# Altium schematic sheet core.SchDoc
size A4
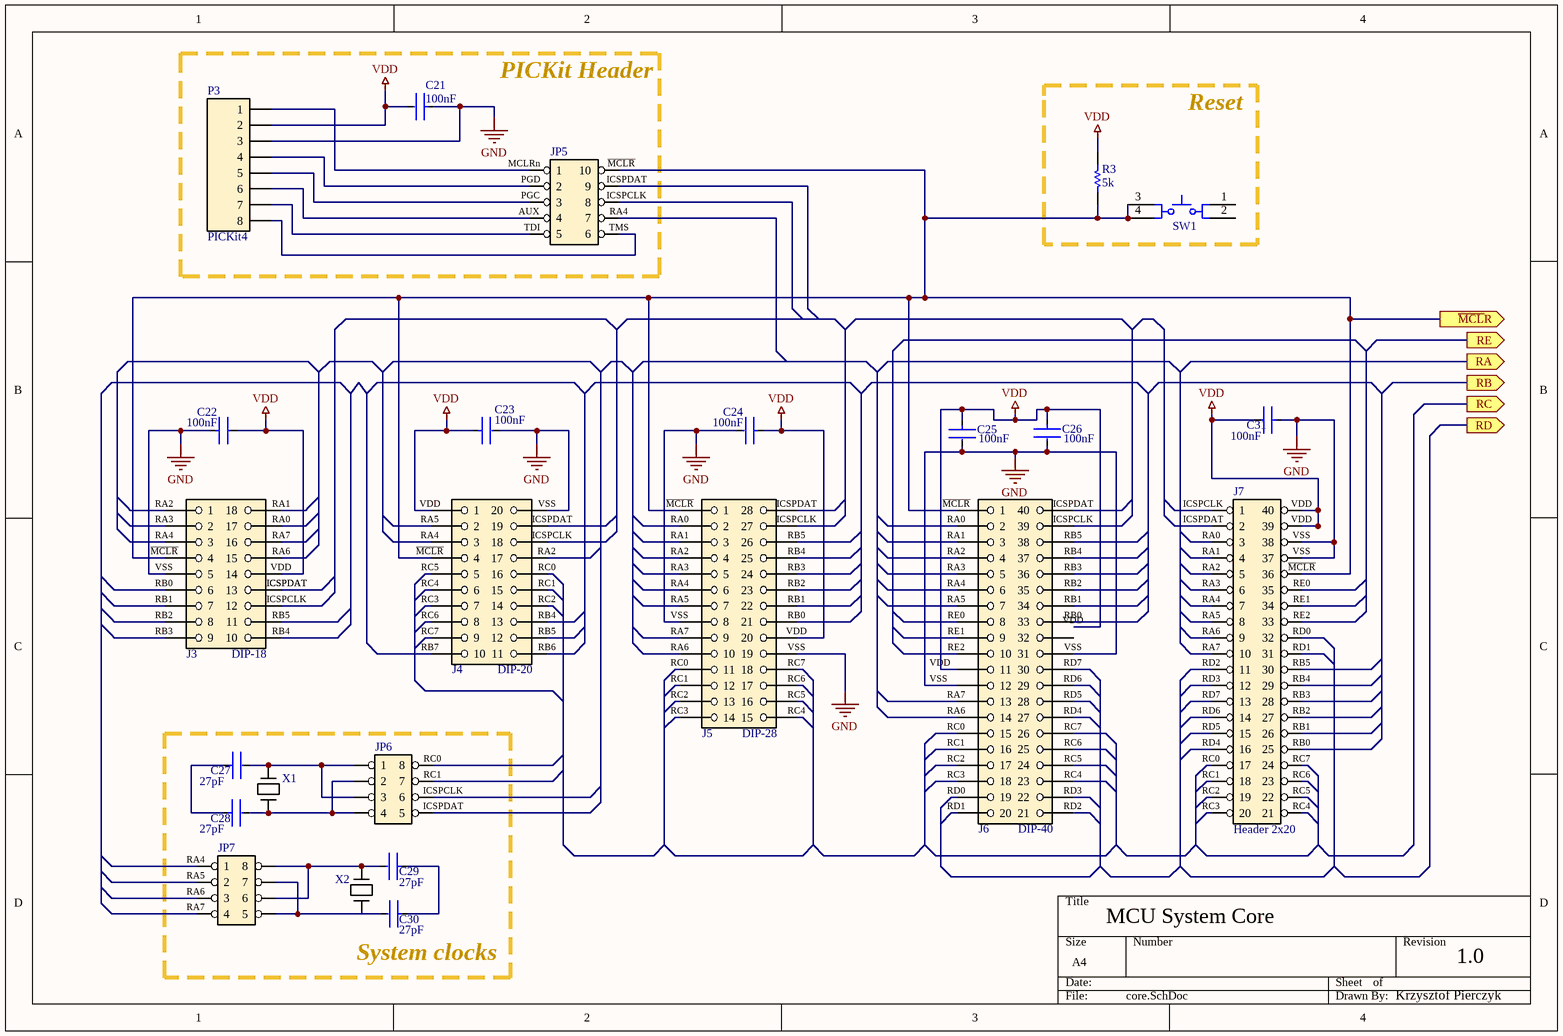
[diagram p0: core.SchDoc]

## Parts
C21  value 100nF  [FP-C0805C-DN-MFG]  (hidden comment: C0805C102J5GACTU)
C22  value 100nF  [FP-C0805C-DN-MFG]  (hidden comment: C0805C102J5GACTU)
C23  value 100nF  [FP-C0805C-DN-MFG]  (hidden comment: C0805C102J5GACTU)
C24  value 100nF  [FP-C0805C-DN-MFG]  (hidden comment: C0805C102J5GACTU)
C25  value 100nF  [FP-C0805C-DN-MFG]  (hidden comment: C0805C102J5GACTU)
C26  value 100nF  [FP-C0805C-DN-MFG]  (hidden comment: C0805C102J5GACTU)
C27  value 27pF  [FP-C0805C-DN-MFG]  (hidden comment: C0805C102J5GACTU)
C28  value 27pF  [FP-C0805C-DN-MFG]  (hidden comment: C0805C102J5GACTU)
C29  value 27pF  [FP-C0805C-DN-MFG]  (hidden comment: C0805C102J5GACTU)
C30  value 27pF  [FP-C0805C-DN-MFG]  (hidden comment: C0805C102J5GACTU)
C31  value 100nF  [FP-C0805C-DN-MFG]  (hidden comment: C0805C102J5GACTU)
J3  DIP-18
J4  DIP-20
J5  DIP-28
J6  DIP-40
J7  Header 2x20
JP5  Header 2x5  (value not drawn)
JP6  Header 2x4  (value not drawn)
JP7  Header 2x4  (value not drawn)
P3  PICKit4
R3  Resistance: 5k  [RESC2013X50X30ML20T20]  (hidden comment: CRCW0805150RFKEA)
SW1  4-1437565-1  [TECO-4-1437565-1_V]  (value not drawn)
X1  HC49SM  (value not drawn)
X2  HC49SM  (value not drawn)

## Blocks framed on the sheet
PICKit Header: C21 JP5 P3
Reset: R3 SW1
System clocks: C27-C30 JP6 JP7 X1 X2

## Ports
RA (out), RB (out), RC (out), RD (out), RE (out), ~{MCL}R (out)

## Nets
VDD: C21.2 C22.2 C23.1 C24.1 C25.1 C26.1 C31.2 J3.14 J4.1 J5.20 J6.11 J7.39 J7.40 P3.2 R3.2
VSS: C21.1 C22.1 C23.2 C24.2 C25.2 C26.2 C31.1 J3.5 J4.20 J5.8 J5.19 J6.12 J6.31 J7.37 J7.38 P3.3  [also labelled GND]
ICSPCLK: J3.12 J4.18 J5.27 J6.39 J7.1 JP5.8 JP6.6
ICSPDAT: J3.13 J4.19 J5.28 J6.40 J7.2 JP5.9 JP6.5
~{MCLR}: J3.4 J4.4 J5.1 J6.1 J7.36 JP5.10 R3.1 SW1.3 SW1.4 ; port ~{MCL}R
RA0: J3.17 J5.2 J6.2 J7.3
RA1: J3.18 J5.3 J6.3 J7.4
RA2: J3.1 J4.17 J5.4 J6.4 J7.5
RA3: J3.2 J5.5 J6.5 J7.6
RA4: J3.3 J4.3 J5.6 J6.6 J7.7 JP5.7 JP7.1
RA5: J4.2 J5.7 J6.7 J7.8 JP7.2
RA6: J3.15 J5.10 J6.14 J7.9 JP7.3
RA7: J3.16 J5.9 J6.13 J7.10 JP7.4
RB0: J3.6 J5.21 J6.33 J7.25
RB1: J3.7 J5.22 J6.34 J7.26
RB2: J3.8 J5.23 J6.35 J7.27
RB3: J3.9 J5.24 J6.36 J7.28
RB4: J3.10 J4.13 J5.25 J6.37 J7.29
RB5: J3.11 J4.12 J5.26 J6.38 J7.30
RB6: J4.11
RB7: J4.10
RC0: J4.16 J5.11 J6.15 J7.17 JP6.8
RC1: J4.15 J5.12 J6.16 J7.18 JP6.7
RC2: J4.14 J5.13 J6.17 J7.19
RC3: J4.7 J5.14 J6.18 J7.20
RC4: J4.6 J5.15 J6.23 J7.21
RC5: J4.5 J5.16 J6.24 J7.22
RC6: J4.8 J5.17 J6.25 J7.23
RC7: J4.9 J5.18 J6.26 J7.24
RD0: J6.19 J7.32
RD1: J6.20 J7.31
RD2: J6.21 J7.11
RD3: J6.22 J7.12
RD4: J6.27 J7.16
RD5: J6.28 J7.15
RD6: J6.29 J7.14
RD7: J6.30 J7.13
RE0: J6.8 J7.35
RE1: J6.9 J7.34
RE2: J6.10 J7.33
NetC27_1: C27.1 C28.1
NetC27_2: C27.2 JP6.1 JP6.3 X1.2
NetC28_2: C28.2 JP6.2 JP6.4 X1.2
NetC29_1: C29.1 C30.1
NetC29_2: C29.2 JP7.6 JP7.8 X2.2
NetC30_2: C30.2 JP7.5 JP7.7 X2.2
NetJP5_1: JP5.1 P3.1
NetJP5_2: JP5.2 P3.4
NetJP5_3: JP5.3 P3.5
NetJP5_4: JP5.4 P3.6
NetJP5_5: JP5.5 P3.7
NetJP5_6: JP5.6 P3.8

Not connected (* = marked no-connect by the designer): J6 32; SW1 1 2

## Notes on the sheet
- (near JP5) MCLRn
- (near JP5) PGD
- (near JP5) AUX
- (near JP5) PGC
- (near JP5) TDI
- (near JP5) TMS
- MCU System Core
- 1.0
- Krzysztof Pierczyk

## Library data of the parts
C21-C31 = CMP-03020-008364-1: CAP CER 1000PF 50V C0G/NP0 0805; Manufacturer: KEMET; Capacitance: 1,000 pF; Temperature Characteristic: C0G; Material: Ceramic; Temperature Coefficient: 30ppm/°C; Tolerance: 0.05; Automotive: No; Voltage Rating: 50 V; Device Class L1: Passive Components; Digikey Description: CAP CER 1000PF 50V C0G/NP0 0805; Lead Free: Yes; Package: C0805C-DN; RoHS: TRUE; Temperature Range High: +125°C; Height: 0.88mm; Ipc Land Pattern Name: CAPC200125X78; Category: Cap; ComponentLink2URL: https://content.kemet.com/datasheets/KEM_C1003_C0G_SMD.pdf; Device Class L2: Capacitors; ComponentLink2Description: Datasheet; Temperature: -55°C to +125°C; Octopart: https://octopart.com/c0805c102j5gactu-kemet-97757; Mouser Description: Multilayer Ceramic Capacitors MLCC - SMD/SMT 50volts 1000pF C0G 5%; Manufacturer Part Number: C0805C102J5GACTU; Device Class L3: Ceramic Capacitors; Temperature Range Low: -55°C
J3 = DIP-18: Current rating: 1A; Voltage rating: 100V; Contact resistance (max): 15mohm; ComponentLink1Description: Datasheet; ComponentLink1URL: http://www.farnell.com/datasheets/2945665.pdf?_ga=2.253269833.1193962280.1589558354-303286379.1586364067&_gac=1.195417566.1589563198.Cj0KCQjw-_j1BRDkARIsAJcfmTFIG7O-lBwUzM7jXL1d54rcmK8ZCJrBZphKUIU-ia_1DnqilNgsh1YaAq1qEALw_wcB
J4 = DIP-20: Current rating: 1A; Voltage rating: 100V; Contact resistance (max): 15mohm; ComponentLink1Description: Datasheet; ComponentLink1URL: http://www.farnell.com/datasheets/2945665.pdf?_ga=2.253269833.1193962280.1589558354-303286379.1586364067&_gac=1.195417566.1589563198.Cj0KCQjw-_j1BRDkARIsAJcfmTFIG7O-lBwUzM7jXL1d54rcmK8ZCJrBZphKUIU-ia_1DnqilNgsh1YaAq1qEALw_wcB
J5 = DIP-28: Current rating: 1A; Voltage rating: 100V; Contact resistance (max): 15mohm; ComponentLink1Description: Datasheet; ComponentLink1URL: http://www.farnell.com/datasheets/2945665.pdf?_ga=2.253269833.1193962280.1589558354-303286379.1586364067&_gac=1.195417566.1589563198.Cj0KCQjw-_j1BRDkARIsAJcfmTFIG7O-lBwUzM7jXL1d54rcmK8ZCJrBZphKUIU-ia_1DnqilNgsh1YaAq1qEALw_wcB
J6 = DIP-40: Current rating: 1A; Voltage rating: 100V; Contact resistance (max): 15mohm; ComponentLink1Description: Datasheet; ComponentLink1URL: http://www.farnell.com/datasheets/2945665.pdf?_ga=2.253269833.1193962280.1589558354-303286379.1586364067&_gac=1.195417566.1589563198.Cj0KCQjw-_j1BRDkARIsAJcfmTFIG7O-lBwUzM7jXL1d54rcmK8ZCJrBZphKUIU-ia_1DnqilNgsh1YaAq1qEALw_wcB
P3 = Header 1x8 A
R3 = CMP-2001-04962-1: Manufacturer: Vishay Dale; Part Number: CRCW0805150RFKEA
SW1 = CMP-2000-05602-1: Tactile Switch, 50 mA, 12 VDC, -20 to 85 degC, 4-Pin SMD, RoHS, Bulk; Manufacturer: TEConnectivity/AMPBrand; Illumination Type: N/R; Maximum Contact Resistance: 100mOhm; Actuator Style: RoundButton; Actuator Length: 1.4mm; Contact Rating @ Voltage: 0.05@12VDCA; Maximum DC Voltage Rating: 12V; Body Orientation: Straight; Ground Terminal: No; Dielectric Strength: 500VAC; Operating Force: 1.57N; Electrical Life: 100000Cycle; Mechanical Life: N/A; Family: FSMJSMA; Contact Material: CopperAlloy; Type: N/A; RoHS: Yes; Pole Throw Configuration: N/A; Operating Temperature: -20to85C; Minimum Insulation Resistance: 100MOhm; Package Description: 4-Pin Surface Mount Device, Body 6 x 6 mm, Pitch 9.1 mm; Housing Material: N/A; Switch Configuration: N/A; Mounting: SurfaceMount,GullWing; Datasheet URL: https://datasheet.ciiva.com/14635/0900766b80912216-14635826.pdf; Packaging: Bulk; Base Material: N/A; Actuator Color: N/A; Dimension: 6x10x5.25mm; Contact Plating: Silver; Seal Location: N/A; Mounting Technology: SurfaceMount; Part No: 4-1437565-1; Seal Description: N/A; Maximum AC Voltage Rating: N/A; Datasheet Version: 04/2007; Manufacturer URL: http://www.te.com/; Package Reference: 4-1437565-1; Product Weight: N/A
X1 X2 = HC49SM: ComponentLink1Description: Datasheet; ComponentLink1URL: https://www.4timing.com/specification/hc49smp.pdf